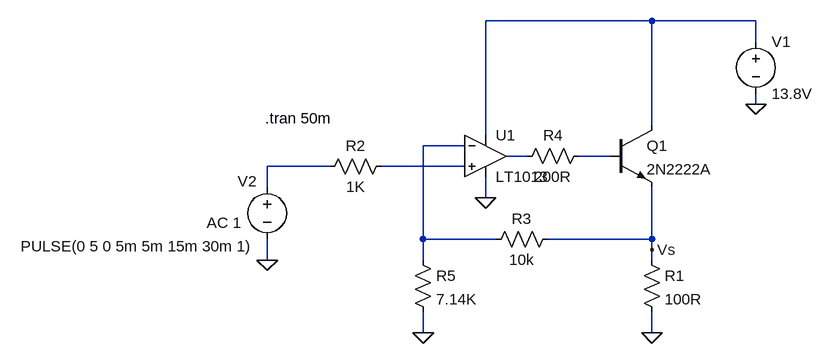
[diagram p0: schematic LM1013 Current Source Test.asc]
LM1013 Current Source Test.asc, the LTspice schematic file:
Version 4
SHEET 1 880 680
WIRE 352 -64 96 -64
WIRE 512 -64 352 -64
WIRE 512 -32 512 -64
WIRE 512 64 512 48
WIRE 352 96 352 -64
WIRE 96 112 96 -64
WIRE 64 128 0 128
WIRE 160 144 128 144
WIRE 288 144 240 144
WIRE -144 160 -240 160
WIRE 64 160 -64 160
WIRE -240 192 -240 160
WIRE 96 208 96 176
WIRE 0 272 0 128
WIRE 112 272 0 272
WIRE 352 272 352 192
WIRE 352 272 192 272
WIRE 352 288 352 272
WIRE -240 304 -240 272
WIRE 0 304 0 272
WIRE 352 304 352 288
WIRE 0 416 0 384
WIRE 352 416 352 384
FLAG 352 416 0
FLAG -240 304 0
FLAG 512 64 0
FLAG 352 288 Vs
FLAG 96 208 0
FLAG 0 416 0
SYMBOL voltage 512 -48 R0
WINDOW 123 0 0 Left 2
WINDOW 39 0 0 Left 2
SYMATTR InstName V1
SYMATTR Value 13.8V
SYMBOL res 336 288 R0
SYMATTR InstName R1
SYMATTR Value 100R
SYMBOL res -48 144 R90
WINDOW 0 0 56 VBottom 2
WINDOW 3 32 56 VTop 2
SYMATTR InstName R2
SYMATTR Value 1K
SYMBOL voltage -240 176 R0
WINDOW 0 -45 7 Left 2
WINDOW 3 -379 107 Left 2
WINDOW 123 -93 71 Left 2
WINDOW 39 0 0 Left 2
SYMATTR InstName V2
SYMATTR Value PULSE(0 5 0 5m 5m 15m 30m 1)
SYMATTR Value2 AC 1
SYMBOL Opamps\\LT1013 96 80 R0
SYMATTR InstName U1
SYMBOL res 208 256 R90
WINDOW 0 0 56 VBottom 2
WINDOW 3 32 56 VTop 2
SYMATTR InstName R3
SYMATTR Value 10k
SYMBOL res -16 288 R0
SYMATTR InstName R5
SYMATTR Value 7.14K
SYMBOL npn 288 96 R0
SYMATTR InstName Q1
SYMATTR Value 2N2222A
SYMBOL res 256 128 R90
WINDOW 0 0 56 VBottom 2
WINDOW 3 32 56 VTop 2
SYMATTR InstName R4
SYMATTR Value 200R
TEXT -243 86 Left 2 !.tran 50m

The netlist it stands for:
* LM1013 Current Source Test.asc
V1 N001 0 13.8V
R1 Vs 0 100R
R2 N006 N005 1K
V2 N005 0 PULSE(0 5 0 5m 5m 15m 30m 1) AC 1
XU1 N006 N002 N001 0 N003 LT1013  ; pins In+ In- V+ V- OUT
R3 Vs N002 10k
R5 N002 0 7.14K
Q1 N001 N004 Vs 0 2N2222A
R4 N004 N003 200R
.model NPN NPN
.model PNP PNP
.lib standard.bjt
.tran 50m
.lib LTC.lib
.backanno
.end